# Altium schematic sheet Supply_0.SchDoc
size A2; Date: Date; CompanyName: HESSO; Engineer: Name; Address1: Route du Rawyl 47; Address2: 1950 Sion; Address3: Switzerland; DocumentNumber: 5; SheetNumber: 5; SheetTotal: 6; ProjectName: Project Name
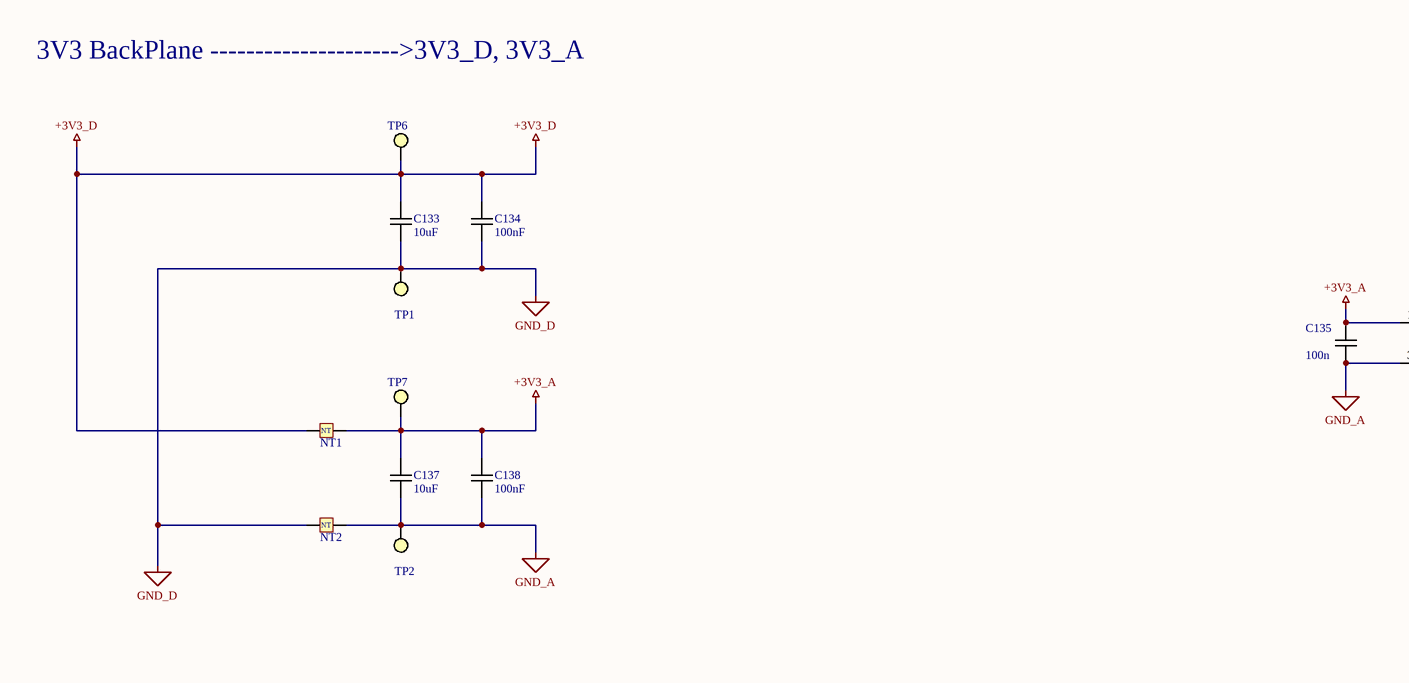
[diagram p0: Supply_0.SchDoc, left]
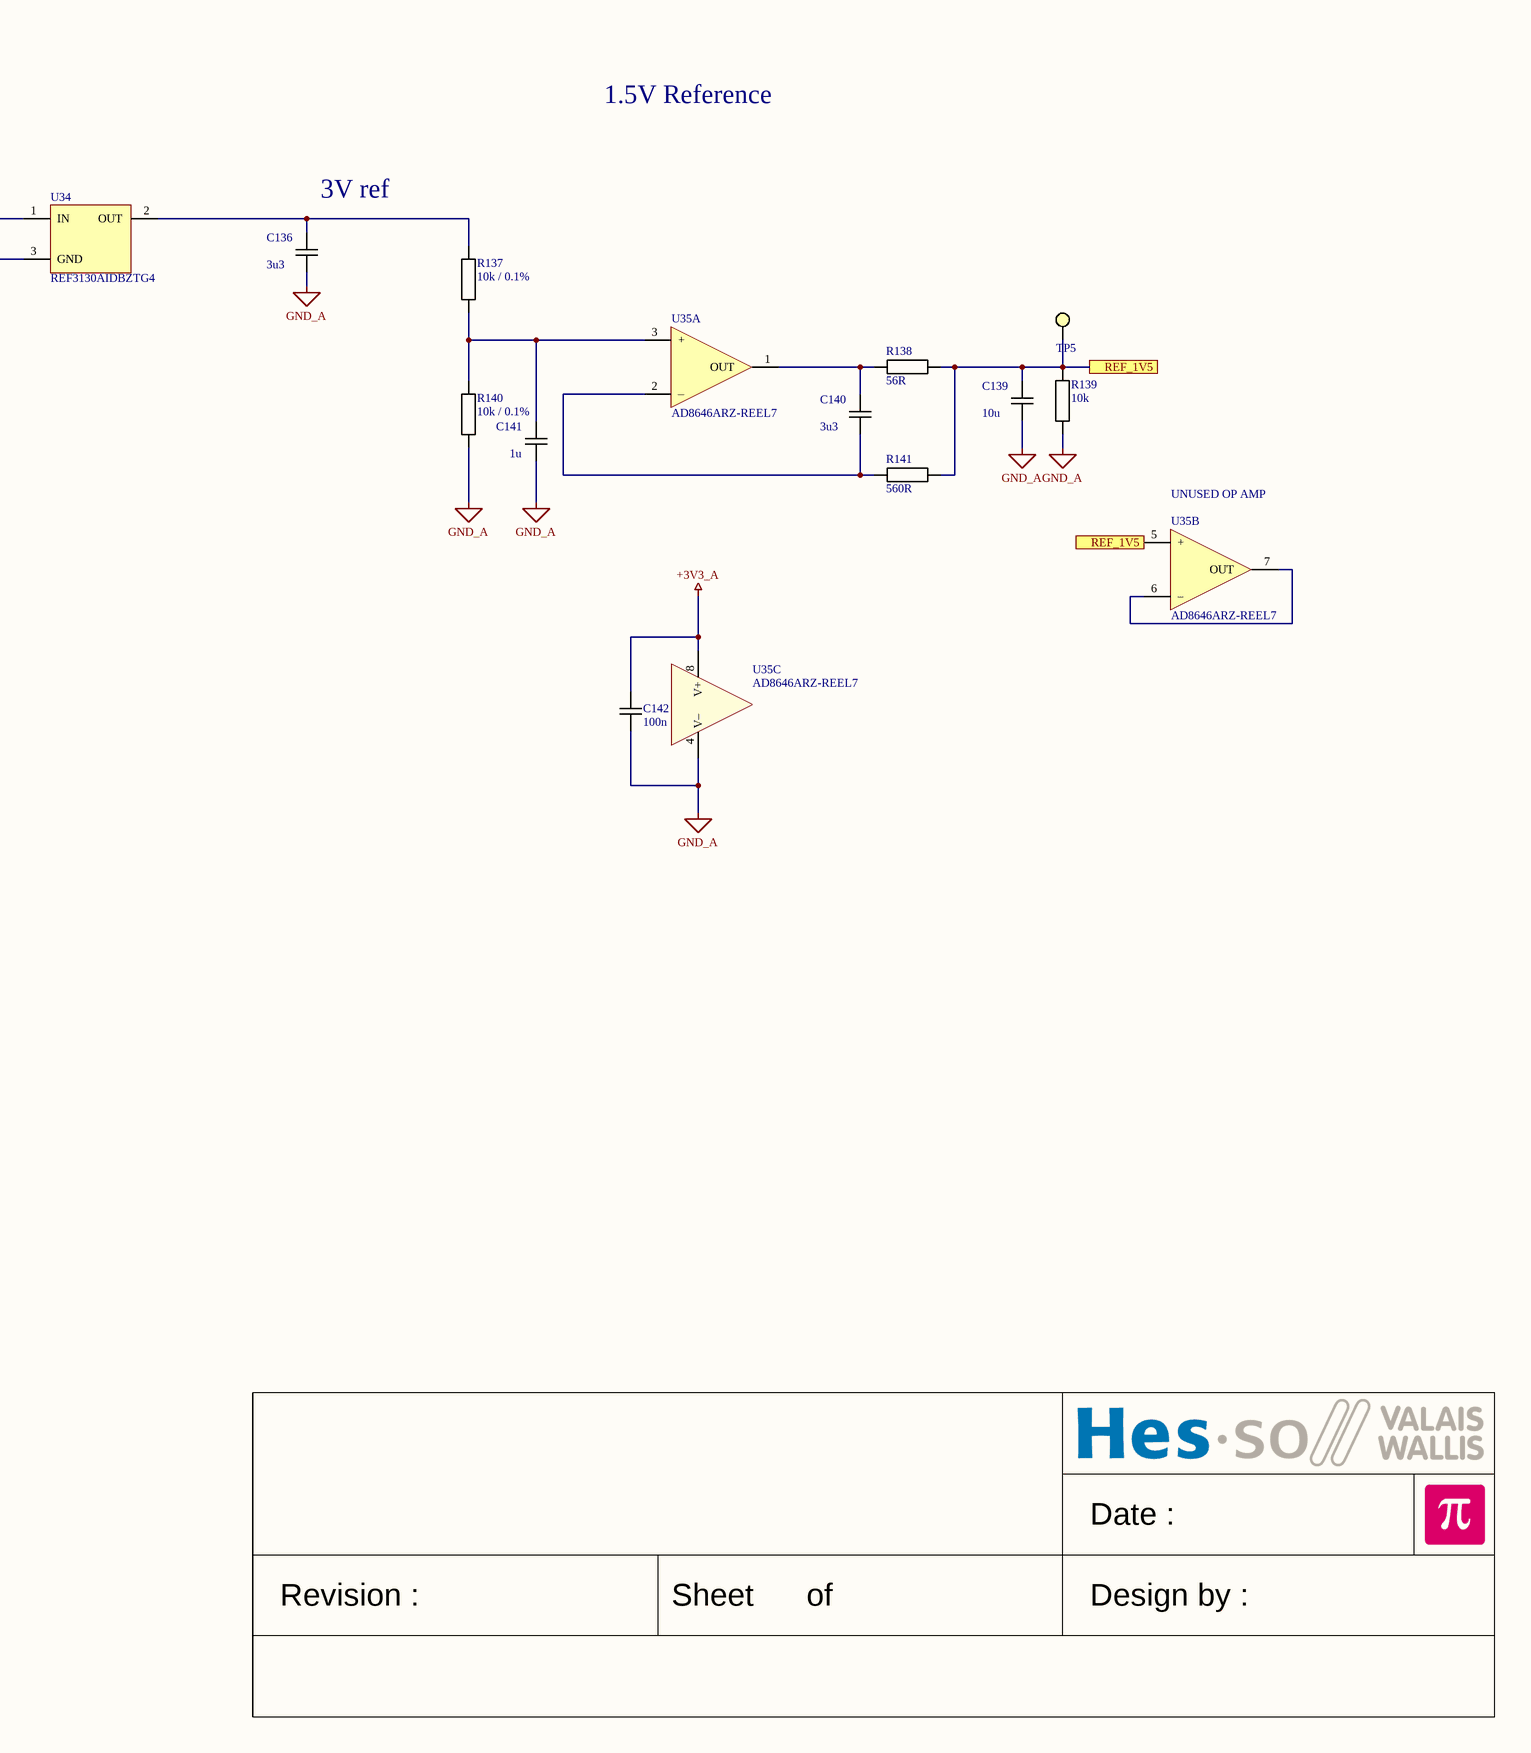
[diagram p1: Supply_0.SchDoc, right]

## Parts
C133  10uF  [CAPACITOR 2012 REFLOW]
C134  100nF  [CAPACITOR 2012 REFLOW]
C135  100n  [CAPACITOR 1608 REFLOW]
C136  3u3  [CAPACITOR 2012 REFLOW]
C137  10uF  [CAPACITOR 2012 REFLOW]
C138  100nF  [CAPACITOR 2012 REFLOW]
C139  10u  [CAPACITOR 2012 REFLOW]
C140  3u3  [CAPACITOR 2012 REFLOW]
C141  1u  [CAPACITOR 2012 REFLOW]
C142  100n  [CAPACITOR 1608 REFLOW]
NT1  Net Tie  [NET TIE 1005]  (value not drawn)  (net tie, no BOM)
NT2  Net Tie  [NET TIE 1005]  (value not drawn)  (net tie, no BOM)
R137  10k / 0.1%  [RESISTOR 1608 REFLOW]
R138  56R  [RESISTOR 1608 REFLOW]
R139  10k  [RESISTOR 1608 REFLOW]
R140  10k / 0.1%  [RESISTOR 1608 REFLOW]
R141  560R  [RESISTOR 1608 REFLOW]
TP1  *  [Test Point Keystone Miniature BLACK]  (value not drawn)
TP2  *  [Test Point Keystone Miniature BLACK]  (value not drawn)
TP5  *  [Test Point Keystone Miniature RED]  (value not drawn)
TP6  *  [Test Point Keystone Miniature BLACK]  (value not drawn)
TP7  *  [Test Point Keystone Miniature BLACK]  (value not drawn)
U34  REF3130AIDBZTG4  [SOT23 P0.95 C1.6x3.0 H1.3]
U35  AD8646ARZ-REEL7  [SO8 P1.27 C4.0X5.0 H1.75]  (parts A,B,C of 3)

## Ports
REF_1V5

## Nets
+3V3_A: C135.2 C137.1 C138.1 C142.2 NT1.2 TP7.1 U34.1(IN) U35.8(V+)
+3V3_D: C133.1 C134.1 NT1.1 TP6.1
GND_A: C135.1 C136.1 C137.2 C138.2 C139.1 C141.1 C142.1 NT2.2 R139.2 R140.2 TP2.1 U34.3(GND) U35.4(V–)
GND_D: C133.2 C134.2 NT2.1 TP1.1
REF_1V5: C139.2 R138.1 R139.1 R141.1 TP5.1 U35.5(+) ; port REF_1V5
NetC136_2: C136.2 R137.2 U34.2(OUT)
NetC140_1: C140.1 R141.2 U35.2(–)
NetC140_2: C140.2 R138.2 U35.1(OUT)
NetC141_2: C141.2 R137.1 R140.1 U35.3(+)
NetU35_6: U35.6(–) U35.7(OUT)

## Notes on the sheet
- 3V3 BackPlane --------------------->3V3_D, 3V3_A
- 1.5V Reference
- (near C136) 3V ref
- (near U35) UNUSED OP AMP
- Date :
- Revision :
- Sheet
- of
- Design by :
- (in symbol Net Tie) NT

## Library data of the parts
C133 C136 C137 C139-C141 = Capacitor: Capacitor X7R 10% 10V 2012(0805)
  C133 C137: Value: 10uF
  C136 C140: Value: 3u3
  C139: Value: 10u
  C141: Value: 1u
C134 C138 = Capacitor: Capacitor X7R 10% 50V 2012(0805); Value: 100nF
C135 C142 = Capacitor: Capacitor X7R 10% 50V 1608(0603); Value: 100n
NT1 NT2 = Net Tie: Connection for 2 different NETNAME
R137-R141 = Resistor: Resistor 1% 50V 100mW 1608(0603)
  R137 R140: Value: 10k / 0.1%
  R138: Value: 56R
  R139: Value: 10k
  R141: Value: 560R
TP1 TP2 TP5-TP7 = Test Point: Value: *
U34 = REFERENCE SOT23 IN,OUT,GND: Generic Positive Voltage Reference; Value: REF3130AIDBZTG4
U35 = OPA DUAL: Generic dual OPA 8 pins; Manufacturer: Analog Devices; Value: AD8646ARZ-REEL7; Mouser No.: 584-AD8646ARZ-R7